# EAGLE schematic RC H-Bridge Ctrl_b (EAGLE 7.5.0)
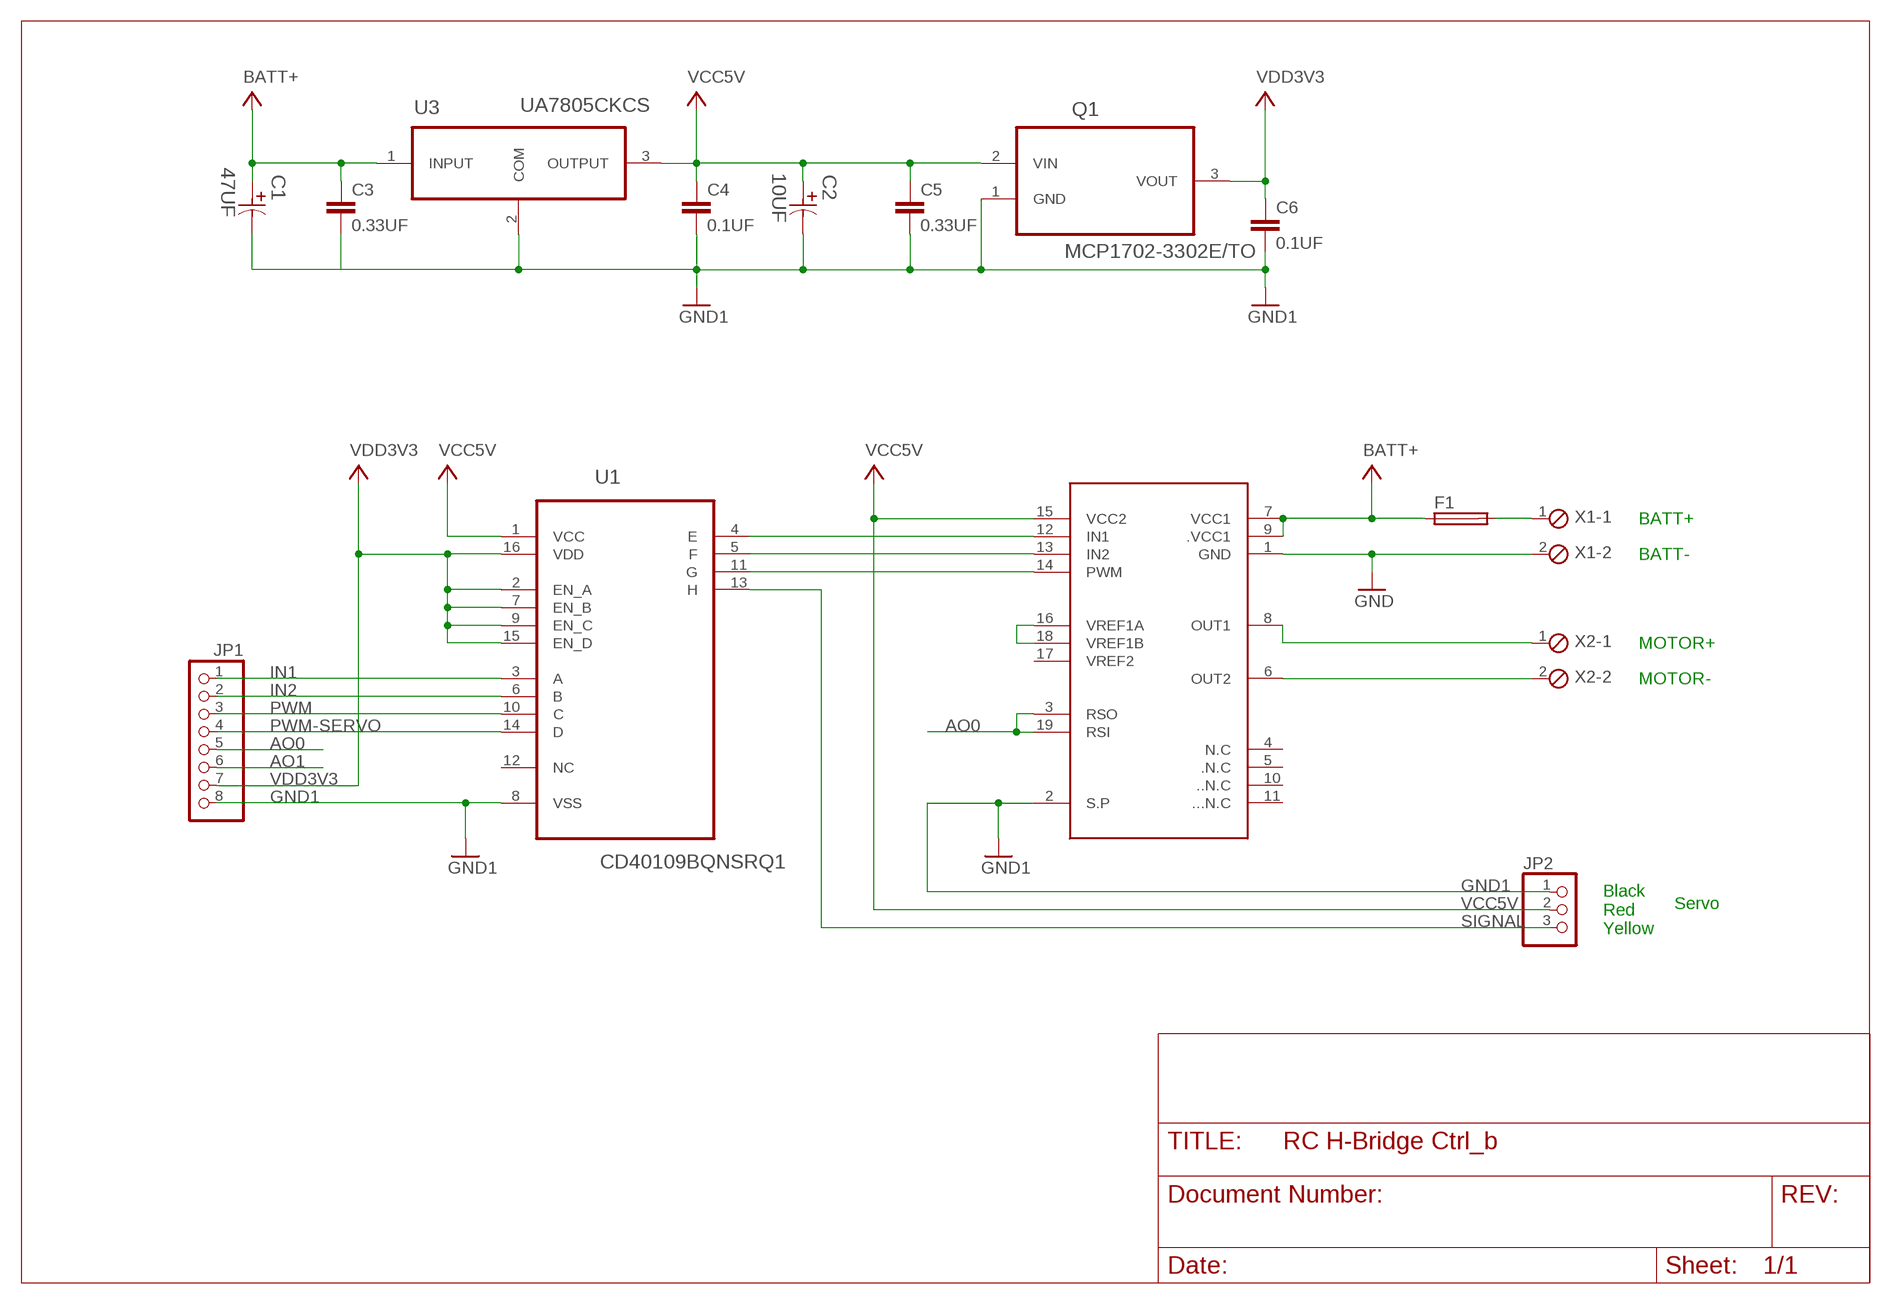
[diagram p0: schematic, sheet 1]

## Parts
C1  47UF  ECA1EHG470-D5XP2  [CAPPR200-500X1100]
C2  10UF  ECA1EM100-D5XP2  [CAPPR200-500X1100]
C3  0.33UF  C5/3  [C5B3]
C4  0.1UF  C5/3  [C5B3]
C5  0.33UF  C5/3  [C5B3]
C6  0.1UF  C5/3  [C5B3]
F1  SH22,5A  [SH22,5A]
JP1  PINHD-1X8  [1X08]
JP2  PINHD-1X3  [1X03]
MD1  MD1  STK681-360-E  [SIP-19]
Q1  MCP1702-3302E/TO  [TO127P254X533-3]
U1  CD40109BQNSRQ1  [SOIC127P780X200-16N]
U3  UA7805CKCS  [TO254P457X1016X2222-3P]
X1  MPT2  [2POL254]
X2  MPT2  [2POL254]

## Nets
AO0: JP1.5 MD1.3(RSO) MD1.19(RSI)
AO1: JP1.6
BATT+: C1.1 C3.1 F1.1 MD1.7(VCC1) MD1.9(.VCC1) U3.1(INPUT)
GND: C1.2 C2.2 C3.2 C4.2 C5.2 C6.2 MD1.1(GND) Q1.1(GND) U3.2(COM) X1.2 ; supply symbol labelled GND1
GND1: JP1.8 JP2.1 MD1.2(S.P) U1.8(VSS)
IN1: JP1.1 U1.3(A)
IN2: JP1.2 U1.6(B)
N$1: MD1.8(OUT1) X2.1
N$2: MD1.6(OUT2) X2.2
N$3: F1.2 X1.1
N$5: MD1.12(IN1) U1.4(E)
N$7: MD1.13(IN2) U1.5(F)
N$8: MD1.14(PWM) U1.11(G)
N$9: MD1.16(VREF1A) MD1.18(VREF1B)
PWM: JP1.3 U1.10(C)
PWM-SERVO: JP1.4 U1.14(D)
SIGNAL: JP2.3 U1.13(H)
VCC5V: C2.1 C4.1 C5.1 JP2.2 MD1.15(VCC2) Q1.2(VIN) U1.1(VCC) U3.3(OUTPUT)
VDD3V3: C6.1 JP1.7 Q1.3(VOUT) U1.2(EN_A) U1.7(EN_B) U1.9(EN_C) U1.15(EN_D) U1.16(VDD)
Unconnected: MD1.4(N.C) MD1.5(.N.C) MD1.10(..N.C) MD1.11(...N.C) MD1.17(VREF2) U1.12(NC)

## Notes on the sheet
- BATT+
- BATT-
- MOTOR+
- MOTOR-
- Black
  Red
  Yellow
- Servo

## Library data of the parts
C1 = Panasonic-ECA_01:ECA: Aluminum Electrolytic Capacitors/Radial Lead Type; MPN: ECA1EHG470; OC_FARNELL: 1848541; OC_NEWARK: 17T5002; PACKAGE: Radial Lead-TH; SUPPLIER: PANASONIC; TOLERANCE: ±20 %; VOLTAGERATING: 25V
C2 = Panasonic-ECA_01:ECA: Aluminum Electrolytic Capacitors/Radial Lead Type; MPN: ECA1EM100; OC_FARNELL: 1907125; OC_NEWARK: 58T1651; PACKAGE: Radial Lead-TH; SUPPLIER: PANASONIC; TOLERANCE: ±20 %; VOLTAGERATING: 25V
C3-C6 = capacitor-wima:C: CAPACITOR naming: grid - package width
F1 = fuse:SH22,5A: FUSE HOLDER grid 22,5mm, isolated cap OGN0031 8201, Schurter (Buerklin); MPN: 0031.7701.11; OC_FARNELL: unknown; OC_NEWARK: 04F1224
JP1 = pinhead:PINHD-1X8: PIN HEADER
JP2 = pinhead:PINHD-1X3: PIN HEADER
MD1 = stk681-360-e:STK681-360-E
Q1 = MCP1702-3302E-TO:MCP1702-3302E/TO: IC, V REG, LDO, 250MA; MPN: MCP1702-3302E/TO; OC_FARNELL: 1331485; OC_NEWARK: 34M7419; PACKAGE: TO-92; SUPPLIER: Microchip
U1 = Texas Instruments_By_element14_Batch_1:CD40109BQNSRQ1: CMOS QUAD LOW-TO-HIGH VOLTAGE SHIFTER; MPN: CD40109BQNSRQ1; OC_FARNELL: -; OC_NEWARK: 79R7923; PACKAGE: SOIC-16; SUPPLIER: Texas Instruments
U3 = TI-UA78M05CKCS:UA7805CKCS: VOLT REG, 5V, 1.5A, TO-220-3; MPN: UA7805CKCS; OC_FARNELL: 2075448; OC_NEWARK: 75M5680; PACKAGE: TO-220-3; SUPPLIER: TEXAS INSTRUMENTS
X1 X2 = con-phoenix-254:MPT2: PHOENIX CONNECTOR; OC_FARNELL: unknown; OC_NEWARK: unknown

## Module STK681
Ports: 

### Library data of the parts